# EAGLE design umbrella-hook (EAGLE 9.6.2)
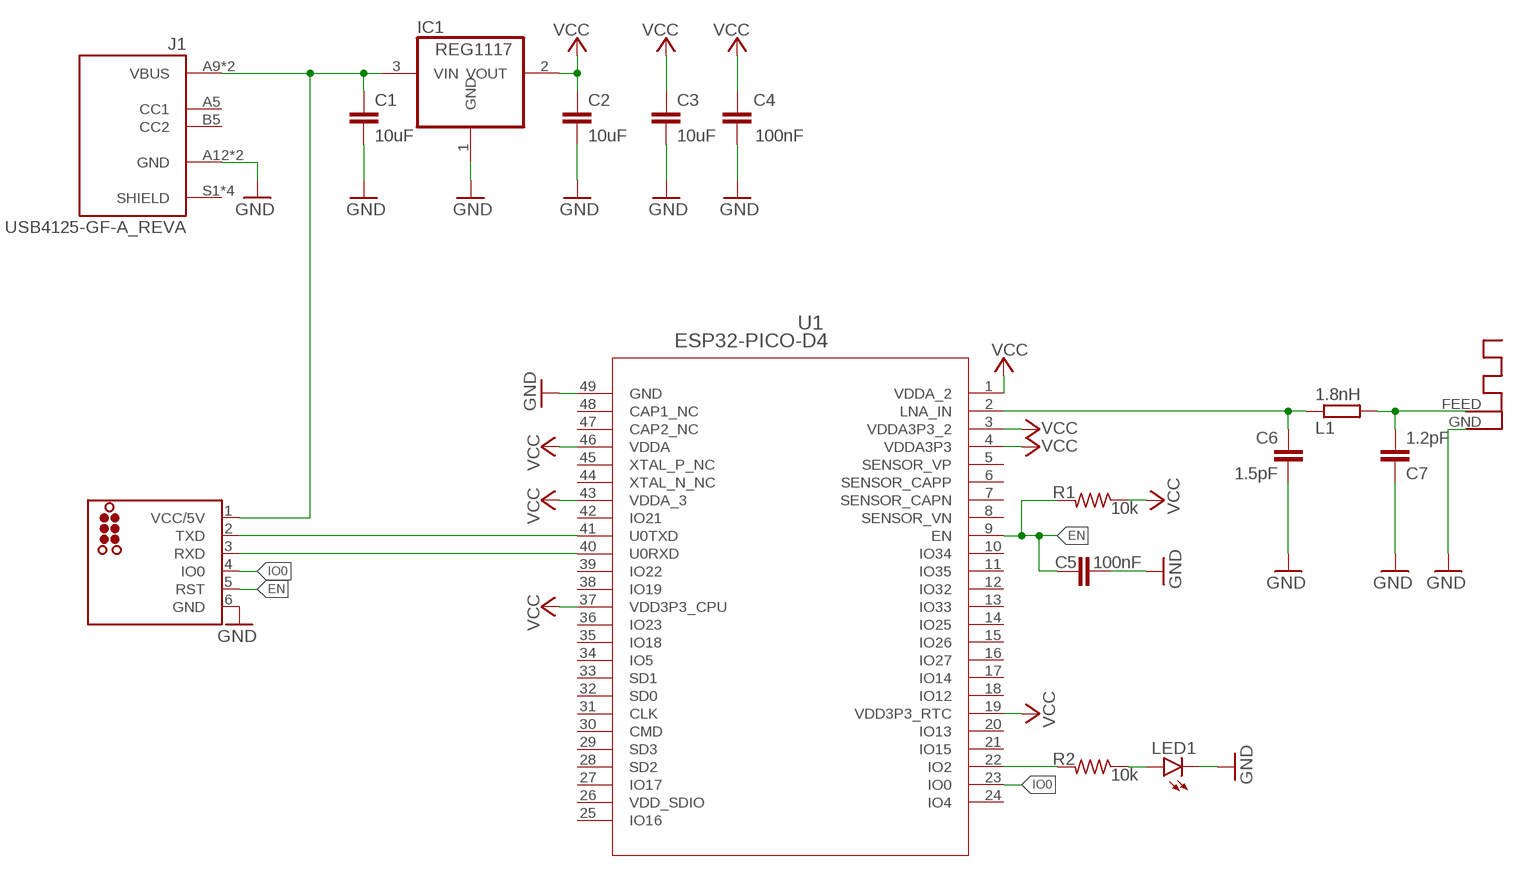
[diagram p0: schematic, sheet 1]

## Parts
ANT1  ANTENNA  [RN-ANT]
C1  10uF  C-EUC0805  [C0805]
C2  10uF  C-EUC0805  [C0805]
C3  10uF  C-EUC0805  [C0805]
C4  100nF  C-EUC0402  [C0402]
C5  100nF  C-EUC0402  [C0402]
C6  1.5pF  C-EUC0402  [C0402]
C7  1.2pF  C-EUC0402  [C0402]
IC1  REG1117  [SOT223]
J1  USB4125-GF-A_REVA  [GCT_USB4125-GF-A_REVA]
J2  TC2030-ESP  [TC2030-MCP]
L1  1.8nH  R-EU_R0402  [R0402]
LED1  LEDCHIP-LED0603  [CHIP-LED0603]
R1  10k  R-US_R0402  [R0402]
R2  10k  R-US_R0402  [R0402]
U1  ESP32-PICO-D4  [ESP32-PICO-D4_EXP]

## Nets
EN: C5.2 J2.5(RST) R1.2 U1.9(EN)
GND: ANT1.GND C1.2 C2.2 C3.2 C4.2 C5.1 C6.2 C7.1 IC1.1(GND) J1.A12(GND) J1.B12(GND) J2.6(GND) LED1.C U1.49(GND)
IO0: J2.4(IO0) U1.23(IO0)
N$1: ANT1.FEED C7.2 L1.2
N$2: C6.1 L1.1 U1.2(LNA_IN)
N$3: R2.2 U1.22(IO2)
N$7: LED1.A R2.1
N$11: C1.1 IC1.3(VIN) J1.A9(VBUS) J1.B9(VBUS) J2.1(VCC/5V)
N$22: J2.2(TXD) U1.41(U0TXD)
N$36: J2.3(RXD) U1.40(U0RXD)
VCC: C2.1 C3.1 C4.1 IC1.2(VOUT) R1.1 U1.1(VDDA_2) U1.3(VDDA3P3_2) U1.4(VDDA3P3) U1.19(VDD3P3_RTC) U1.37(VDD3P3_CPU) U1.43(VDDA_3) U1.46(VDDA)
Unconnected: J1.A5(CC1) J1.B5(CC2) J1.S1(SHIELD) J1.S2(SHIELD) J1.S3(SHIELD) J1.S4(SHIELD) U1.5(SENSOR_VP) U1.6(SENSOR_CAPP) U1.7(SENSOR_CAPN) U1.8(SENSOR_VN) U1.10(IO34) U1.11(IO35) U1.12(IO32) U1.13(IO33) U1.14(IO25) U1.15(IO26) U1.16(IO27) U1.17(IO14) U1.18(IO12) U1.20(IO13) U1.21(IO15) U1.24(IO4) U1.25(IO16) U1.27(IO17) U1.28(SD2) U1.29(SD3) U1.30(CMD) U1.31(CLK) U1.32(SD0) U1.33(SD1) U1.34(IO5) U1.35(IO18) U1.36(IO23) U1.38(IO19) U1.39(IO22) U1.42(IO21) U1.44(XTAL_N_NC) U1.45(XTAL_P_NC) U1.47(CAP2_NC) U1.48(CAP1_NC)

## Power pins joined to a net without a drawn wire
VDD_SDIO: U1.26(VDD_SDIO)

## Library data of the parts
ANT1 = adafruit:ANTENNA
C1-C7 = rcl:C-EU: CAPACITOR, European symbol; SPICEPREFIX: C
IC1 = burr-brown:REG1117: 800mA and 1A Low Dropout (LDO) Positive Regulator 1.8V, 2.5V, 2.85V, 3.3V, 5V, and Adj; MPN: REG1117; OC_FARNELL: 1097566; OC_NEWARK: 14P6981
J1 = USB4125-GF-A_REVA:USB4125-GF-A_REVA: USB 2.0 Type C Receptacle, Horizontal, SMT, For Power charging; DESCRIPTION: USB Charge Only Connector Type C Horizontal Receptacle, 3.16mm profile, 6 Pins, Surface mount, Top mount, low cost; MF: Global Connector Technology; MP: USB4125-GF-A; PACKAGE: None; PURCHASE-URL: https://pricing.snapeda.com/search/part/USB4125-GF-A/?ref=eda
J2 = tag-connect:TC2030-ESP
L1 = rcl:R-EU_: RESISTOR, European symbol; SPICEPREFIX: L
LED1 = led:LED: LED OSRAM: - CHIPLED LG R971, LG N971, LY N971, LG Q971, LY Q971, LO R971, LY R971 LH N974, LH R974 LS Q976, LO Q976, LY Q976 LO Q996 - Hyper CHIPLED LW Q18S LB Q993, LB Q99A, LB R99A - SideLED LS A670, LO A670, LY A670, LG A670, LP A670 LB A673, LV A673, LT A673, LW A673 LH A674 LY A675 LS A676, LA A676, LO A676, LY A676, LW A676 LS A679, LY A679, LG A679 - Hyper Micro SIDELED® LS Y876, LA Y876, LO Y876, LY Y876 LT Y87S - SmartLED LW L88C, LW L88S LB L89C, LB L89S, LG L890 LS L89K, LO L89K, LY L89K LS L896, LA L896, LO L896, LY L896 - TOPLED LS T670, LO T670, LY T670, LG T670, LP T670 LSG T670, LSP T670, LSY T670, LOP T670, LYG T670 LG T671, LOG T671, LSG T671 LB T673, LV T673, LT T673, LW T673 LH T674 LS T676, LA T676, LO T676, LY T676, LB T676, LH T676, LSB T676, LW T676 LB T67C, LV T67C, LT T67C, LS T67K, LO T67K, LY T67K, LW E67C LS E67B, LA E67B, LO E67B, LY E67B, LB E67C, LV E67C, LT E67C LW T67C LS T679, LY T679, LG T679 LS T770, LO T770, LY T770, LG T770, LP T770 LB T773, LV T773, LT T773, LW T773 LH T774 LS E675, LA E675, LY E675, LS T675 LS T776, LA T776, LO T776, LY T776, LB T776 LHGB T686 LT T68C, LB T68C - Hyper Mini TOPLED® LB M676 - Mini TOPLED Santana® LG M470 LS M47K, LO M47K, LY M47K Source: http://www.osram.convergy.de LUXEON: - LUMILED® LXK2-PW12-R00, LXK2-PW12-S00, LXK2-PW14-U00, LXK2-PW14-V00 LXK2-PM12-R00, LXK2-PM12-S00, LXK2-PM14-U00 LXK2-PE12-Q00, LXK2-PE12-R00, LXK2-PE12-S00, LXK2-PE14-T00, LXK2-PE14-U00 LXK2-PB12-K00, LXK2-PB12-L00, LXK2-PB12-M00, LXK2-PB14-N00, LXK2-PB14-P00, LXK2-PB14-Q00 LXK2-PR12-L00, LXK2-PR12-M00, LXK2-PR14-Q00, LXK2-PR14-R00 LXK2-PD12-Q00, LXK2-PD12-R00, LXK2-PD12-S00 LXK2-PH12-R00, LXK2-PH12-S00 LXK2-PL12-P00, LXK2-PL12-Q00, LXK2-PL12-R00 Source: www.luxeon.com KINGBRIGHT: KA-3528ASYC Source: www.kingbright.com
R1 R2 = rcl:R-US_: RESISTOR, American symbol; SPICEPREFIX: R
U1 = esp32picod4:ESP32-PICO-D4; BUILT_BY: EMA_Cory; COPYRIGHT: Copyright (C) 2018 Accelerated Designs. All rights reserved; DATASHEET: https://www.espressif.com/sites/default/files/documentation/esp32-pico-d4_datasheet_en.pdf; MANUFACTURER_PART_NUMBER: ESP32-PICO-D4; SOURCELIBRARY: Espressif_Systems_2020-04-10; VENDOR: Espressif Systems

## Board
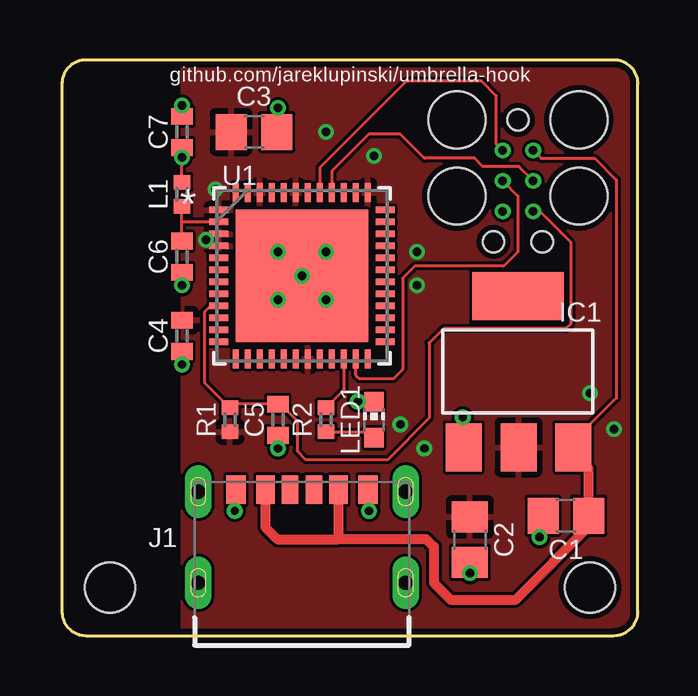
[diagram p1: board, top side]
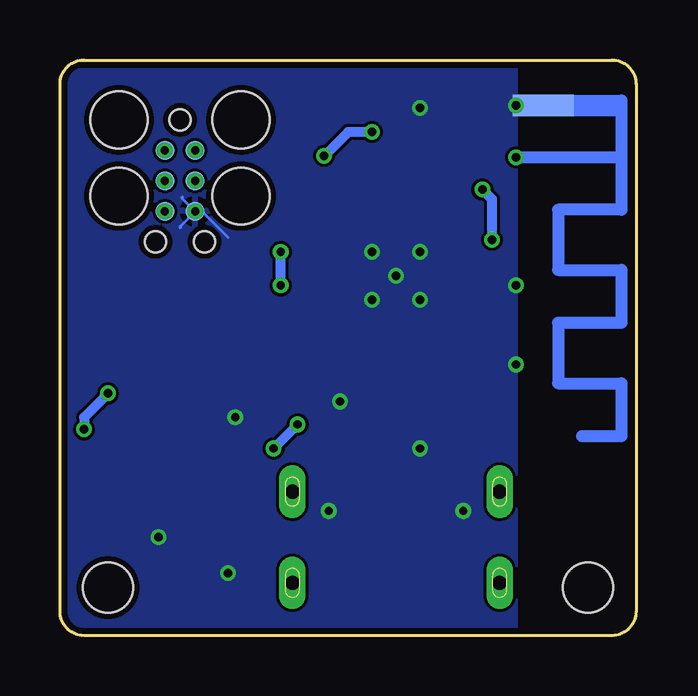
[diagram p2: board, bottom side, seen from below]

Size 24 x 24 mm. Coordinates in mm from the lower left corner, seen from the top.
Outline: 0,23 0,1 arc90 1,0 23,0 arc90 24,1 24,23 arc90 23,24 1,24 arc90 0,23
Copper layers (1*16): Top 0.035mm / dielectric 1.5mm / Bottom 0.035mm
Design rules "MF_Standard_2_Layer": minimum track width 5mil, minimum drill 12mil, track to track 5mil, track to pad 5mil, pad to pad 5mil, via to via 5mil, smd to smd 0mil, copper to edge 10mil, drill to drill 10mil, minimum pad ring 6mil, minimum via ring 6mil, stop-mask expansion 2mil, vias tented up to drill 25mil, thermal gap 10mil
Holes 2.1 mm at 2,2 22,2

### Footprints (pad centres in the part's own frame; a part is rotated, then mirrored left to right if it is on the bottom)
RN-ANT = smd 0.025 x 0.025: FEED 0,2.159 | smd 2.54 x 0.889: GND -1.143,0
C0805 = smd 1.3 x 1.5: 1 -0.95,0; 2 0.95,0
C0402 = smd 0.7 x 0.9: 1 -0.65,0; 2 0.65,0
SOT223 = smd 1.499 x 2.007: 1 -2.261,-3.15; 2 0.025,-3.15; 3 2.311,-3.15 | smd 3.81 x 2.007: 4 0,3.15
GCT_USB4125-GF-A_REVA = smd 0.7 x 1.2: A5 -0.5,0.08; B5 0.5,0.08 | smd 0.76 x 1.2: A9 1.52,0.08; B9 -1.52,0.08 | smd 0.8 x 1.2: A12 2.75,0.08; B12 -2.75,0.08 | drill 0.6 pad 1.1 long: S1 -4.32,0; S2 4.32,0; S3 -4.32,-3.8; S4 4.32,-3.8
TC2030-MCP = smd 0.787 x 0.787: 1 1.27,-0.635; 2 1.27,0.635; 3 2.54,-0.635; 4 2.54,0.635; 5 3.81,-0.635; 6 3.81,0.635 | hole 0.889: 0,0; 5.08,-1.016; 5.08,1.016 | hole 2.375: 0,2.54; 0,-2.54; 3.175,-2.54; 3.175,2.54
R0402 = smd 0.6 x 0.7: 1 -0.5,0; 2 0.5,0
CHIP-LED0603 = smd 0.8 x 0.8: A 0,-0.75; C 0,0.75
ESP32-PICO-D4_EXP = smd 0.787 x 0.254: 1 -3.467,2.75; 2 -3.467,2.25; 3 -3.467,1.75; 4 -3.467,1.25; 5 -3.467,0.75; 6 -3.467,0.25; 7 -3.467,-0.25; 8 -3.467,-0.75; 9 -3.467,-1.25; 10 -3.467,-1.75; 11 -3.467,-2.25; 12 -3.467,-2.75; 25 3.467,-2.75; 26 3.467,-2.25; 27 3.467,-1.75; 28 3.467,-1.25; 29 3.467,-0.75; 30 3.467,-0.25; 31 3.467,0.25; 32 3.467,0.75; 33 3.467,1.25; 34 3.467,1.75; 35 3.467,2.25; 36 3.467,2.75 | smd 0.254 x 0.787: 13 -2.75,-3.467; 14 -2.25,-3.467; 15 -1.75,-3.467; 16 -1.25,-3.467; 17 -0.75,-3.467; 18 -0.25,-3.467; 19 0.25,-3.467; 20 0.75,-3.467; 21 1.25,-3.467; 22 1.75,-3.467; 23 2.25,-3.467; 24 2.75,-3.467; 37 2.75,3.467; 38 2.25,3.467; 39 1.75,3.467; 40 1.25,3.467; 41 0.75,3.467; 42 0.25,3.467; 43 -0.25,3.467; 44 -0.75,3.467; 45 -1.25,3.467; 46 -1.75,3.467; 47 -2.25,3.467; 48 -2.75,3.467 | smd 5.512 x 5.512: 49 0,0

### Placement (x,y rotation side)
ANT1  5,22.1 180 bottom
C1  21,5 180 top
C2  17,4 270 top
C3  8,21 0 top
C4  5,12.5 270 top
C5  9,9 90 top
C6  5,15.8 270 top
C7  5,21 270 top
IC1  19,11 0 top
J1  10,6 0 top
J2  19,21.5 270 bottom
L1  5,18.4 90 top
LED1  13,9 0 top
R1  7,9 90 top
R2  11,9 90 top
U1  10,15 0 top

### Tracks (layer width: path | path; a pad name or v marks a point on that pad's centre or on a via)
EN  (via drill 0.35)
  Top 0.127: U1.9 6.19,13.75 5.94,13.5 5.94,10.56 R1.2 7.15,9.65 C5.2 9.1,9.65 9.8,8.95 9.8,7.7 10.17,7.33 13.57,7.33 15.3,9.06 15.3,12.2 15.9,12.8 21,12.8 21.2,13 21.2,16.4 20.8,16.8 19.91,17.69 J2.5
  other vias: 19.64,17.69
GND  (via drill 0.35)
  Top 0.127: C7.1 v5,22.1 | C3.2 8.95,21.95 v9,22 | U1.49 v9,16 | U1.49 v11,16 | U1.49 v9,14 | U1.49 v11,14 | C6.2 v5,14.6 | v12.8,5.2 12.75,5.25 J1.A12 | J1.B12 7.25,5.25 v7.2,5.2 | C4.2 v5,11.3 | C5.1 v9,7.8 | LED1.C v12.34,9.75 v12.33,9.76 | IC1.1 16.74,9.06 v16.7,9.1 | C2.2 v17,2.6 | C1.2 20.05,4.25 v19.9,4.1
  Bottom 0.127: ANT1.GND v5,22.1 | J2.6 18.09,17.69 17,16.6 | J2.6 19,17.05 19,17 | J2.6 18.9,18.23 18.9,18.3
  other vias: 10,15 18.36,17.69
  pour Bottom: 5,0 24,0 24,24 5,24
IO0  (via drill 0.35)
  Top 0.127: J2.4 19,18.32 19,16 18.4,15.4 14.7,15.4 14.2,14.9 14.2,11.1 13.8,10.7 12.4,10.7 12.25,10.85 U1.23
  other vias: 18.36,18.96
N$1  (via drill 0.35)
  Top 0.127: C7.2 ANT1.FEED L1.2
  other vias: 5,19.94
N$2
  Top 0.127: U1.2 5,17.25 L1.1 C6.1
N$3
  Top 0.127: U1.22 11.75,10.25 R2.2
N$7
  Top 0.127: R2.1 12.75,8.5 LED1.A
N$11  (via drill 0.35)
  Top 0.127: J2.1 19.96,19.9 22.2,19.9 23.1,19 23.1,9.9 21.31,8.11 IC1.3 21.31,7.59 | C1.1 21.95,4.55
  Top 0.406: J1.B9 8.48,4.52 8.98,4.02 11.52,4.02 | J1.A9 11.52,4.02 | C1.1 21.95,6.95 21.31,7.59 | 11.52,4.02 15.18,4.02 15.5,3.7 15.5,2.2 16.2,1.5 18.9,1.5 21.95,4.55
  other vias: 19.64,20.23
N$22  (via drill 0.35)
  Top 0.127: J2.2 18.1,20.5 18.1,22.5 17.5,23.11 14.35,23.11 10.75,19.5 U1.41
  other vias: 18.36,20.23
N$36  (via drill 0.35)
  Top 0.127: J2.3 19.04,19.56 17.54,19.56 17.2,19.9 15.1,19.9 14.1,20.9 12.78,20.9 11.25,19.37 U1.40
  other vias: 19.64,18.96
VCC  (via drill 0.35)
  Bottom 0.406: v11,21 12,21 v13,20 | v14.8,14.6 v14.8,16 | v6,16.5 6,18.2 v6.4,18.6 | v15.1,7.8 v14.1,8.8 | v22,10.1 23,9.1 v23,8.6
  pour Top: 5,0 24,0 24,24 5,24

### Text on the board
tPlace: github.com/jareklupinski/umbrella-hook